# Altium schematic sheet CarPower.SchDoc
size A4; SheetNumber: 2; SheetTotal: 4
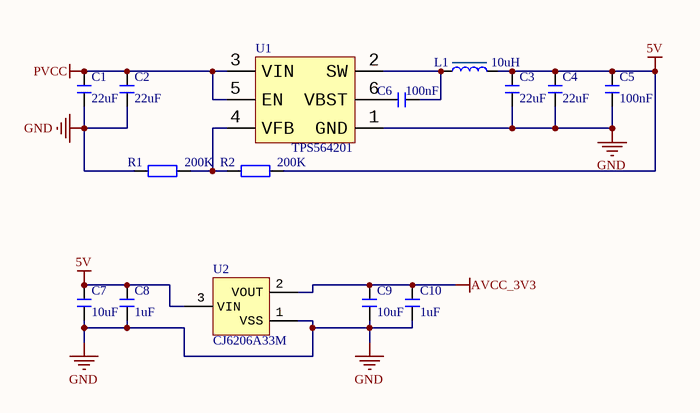
[diagram p0: CarPower.SchDoc]

## Parts
C1  22uF  [C 0805_L]
C2  22uF  [C 0805_L]
C3  22uF  [C 0603_L]
C4  22uF  [C 0603_L]
C5  100nF  [C 0402_L]
C6  100nF  [C 0402_L]
C7  10uF  [C 0402_L]
C8  1uF  [C 0402_L]
C9  10uF  [C 0402_L]
C10  1uF  [C 0402_L]
L1  10uH  [L-0630]
R1  200K  [R 0402_L]
R2  200K  [R 0402_L]
U1  TPS564201  [SOT23-6L]
U2  CJ6206A33M  [SOT23-3L]

## Nets
5V: C3.2 C4.2 C5.2 C7.2 C8.2 L1.2 R2.2 U2.3(VIN)
AVCC_3V3: C9.2 C10.2 U2.2(VOUT)
GND: C1.1 C2.1 C3.1 C4.1 C5.1 C7.1 C8.1 C9.1 C10.1 R1.1 U1.1(GND) U2.1(VSS)
PVCC: C1.2 C2.2 U1.3(VIN) U1.5(EN)
NetC6_1: C6.1 U1.6(VBST)
NetC6_2: C6.2 L1.1 U1.2(SW)
NetR1_2: R1.2 R2.1 U1.4(VFB)

## Library data of the parts
C1-C10 = C: 无极性贴片电容; 版权归属: 源创客; BOM名称: 无极性贴片电容; 学习资源: www.ooocke.com
L1 = L-CD: 贴片功率电感; BOM名称: 功率电感; 版权归属: 源创客; 学习资源: www.ooocke.com
R1 R2 = R: 贴片电阻; 版权归属: 源创客; BOM名称: 贴片电阻; 学习资源: www.ooocke.com
U1 = TPS563200: 3A  4.5V-17V输入 同步
U2 = LN6206PXXX: 三端稳压芯片 / 6V 250mA